# Altium schematic sheet [04] - REVISION HISTORY.SchDoc
size Letter; CheckedBy: Pablo M.; DocumentNumber: 4; Revision: v1; SheetNumber: 4; SheetTotal: 5
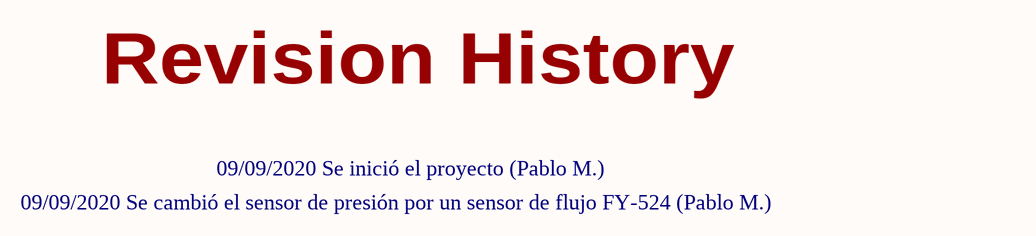
[diagram p0: [04] - REVISION HISTORY.SchDoc]

## Notes on the sheet
- Revision History
- 09/09/2020 Se inició el proyecto (Pablo M.)
- 09/09/2020 Se cambió el sensor de presión por un sensor de flujo FY-524 (Pablo M.)
- Project Name:
- Page Contents:
- Size:
- Revision:
- Letter
- Design:
- Document Number:
- Date:
- Sheet:
- of